# Altium schematic sheet BLOCK_DIAGRAM.SchDoc
size A4
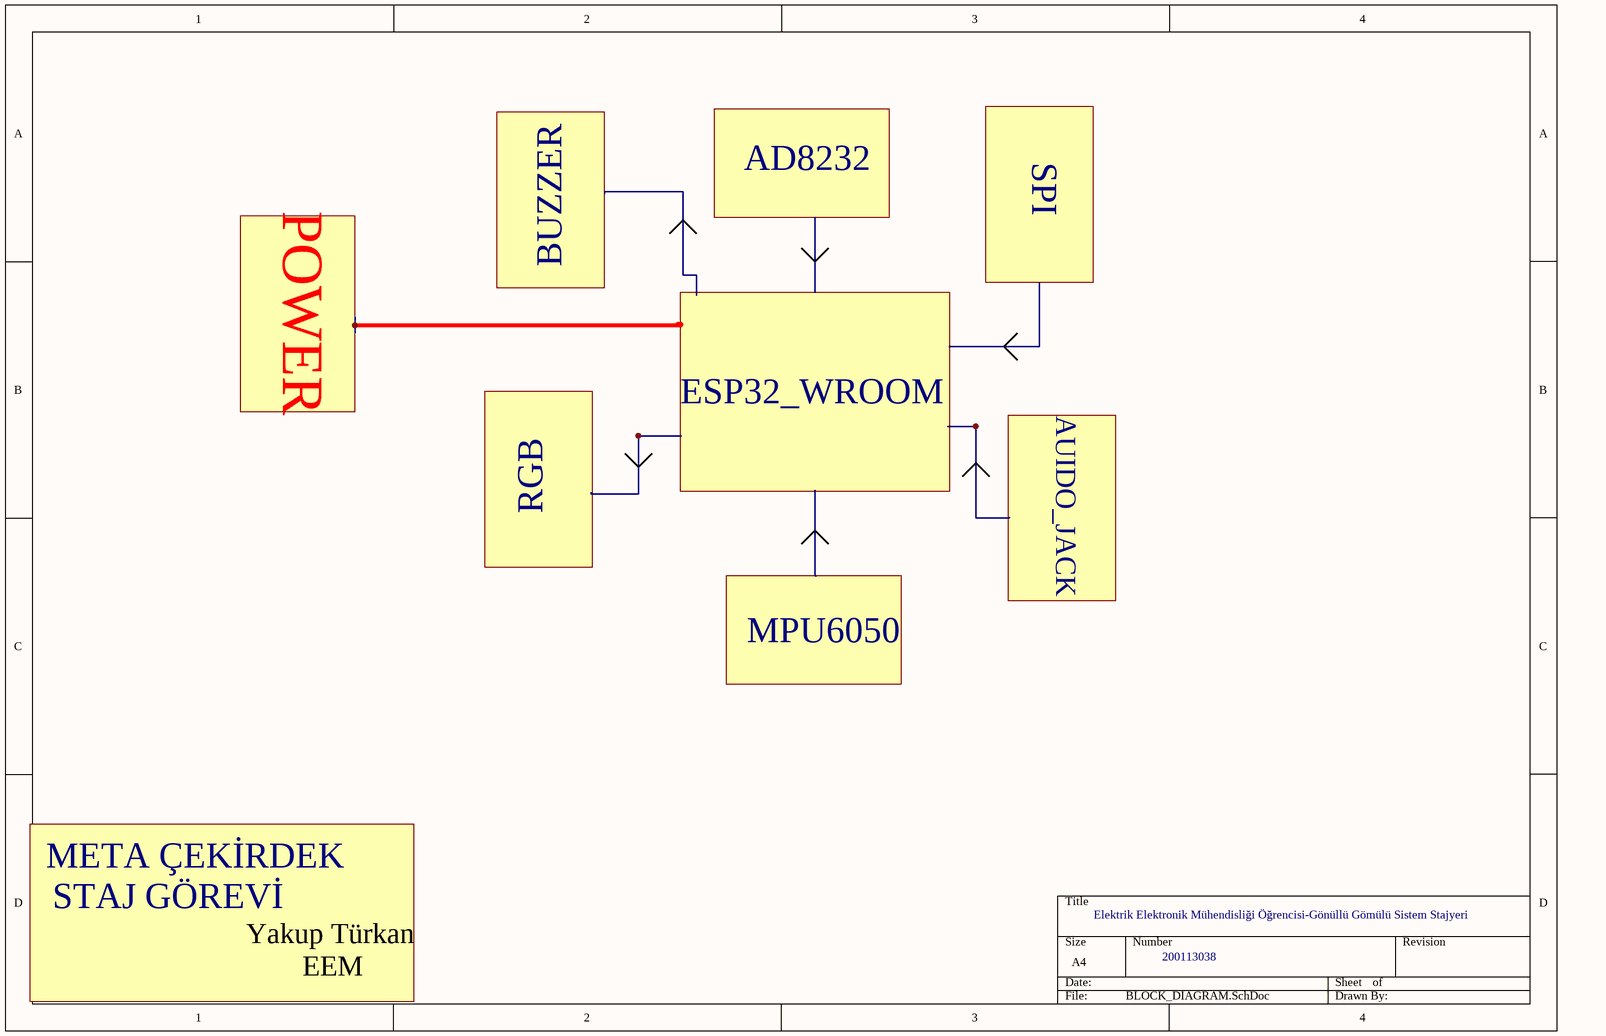
[diagram p0: BLOCK_DIAGRAM.SchDoc]

## Notes on the sheet
- AD8232
- SPI
- POWER
- BUZZER
- ESP32_WROOM
- AUIDO_JACK
- RGB
- MPU6050
- STAJ GÖREVİ
- META ÇEKİRDEK
- Elektrik Elektronik Mühendisliği Öğrencisi-Gönüllü Gömülü Sistem Stajyeri
- Yakup Türkan
- EEM
- 200113038